# EAGLE design s-ispv2 (EAGLE 7.5.0)
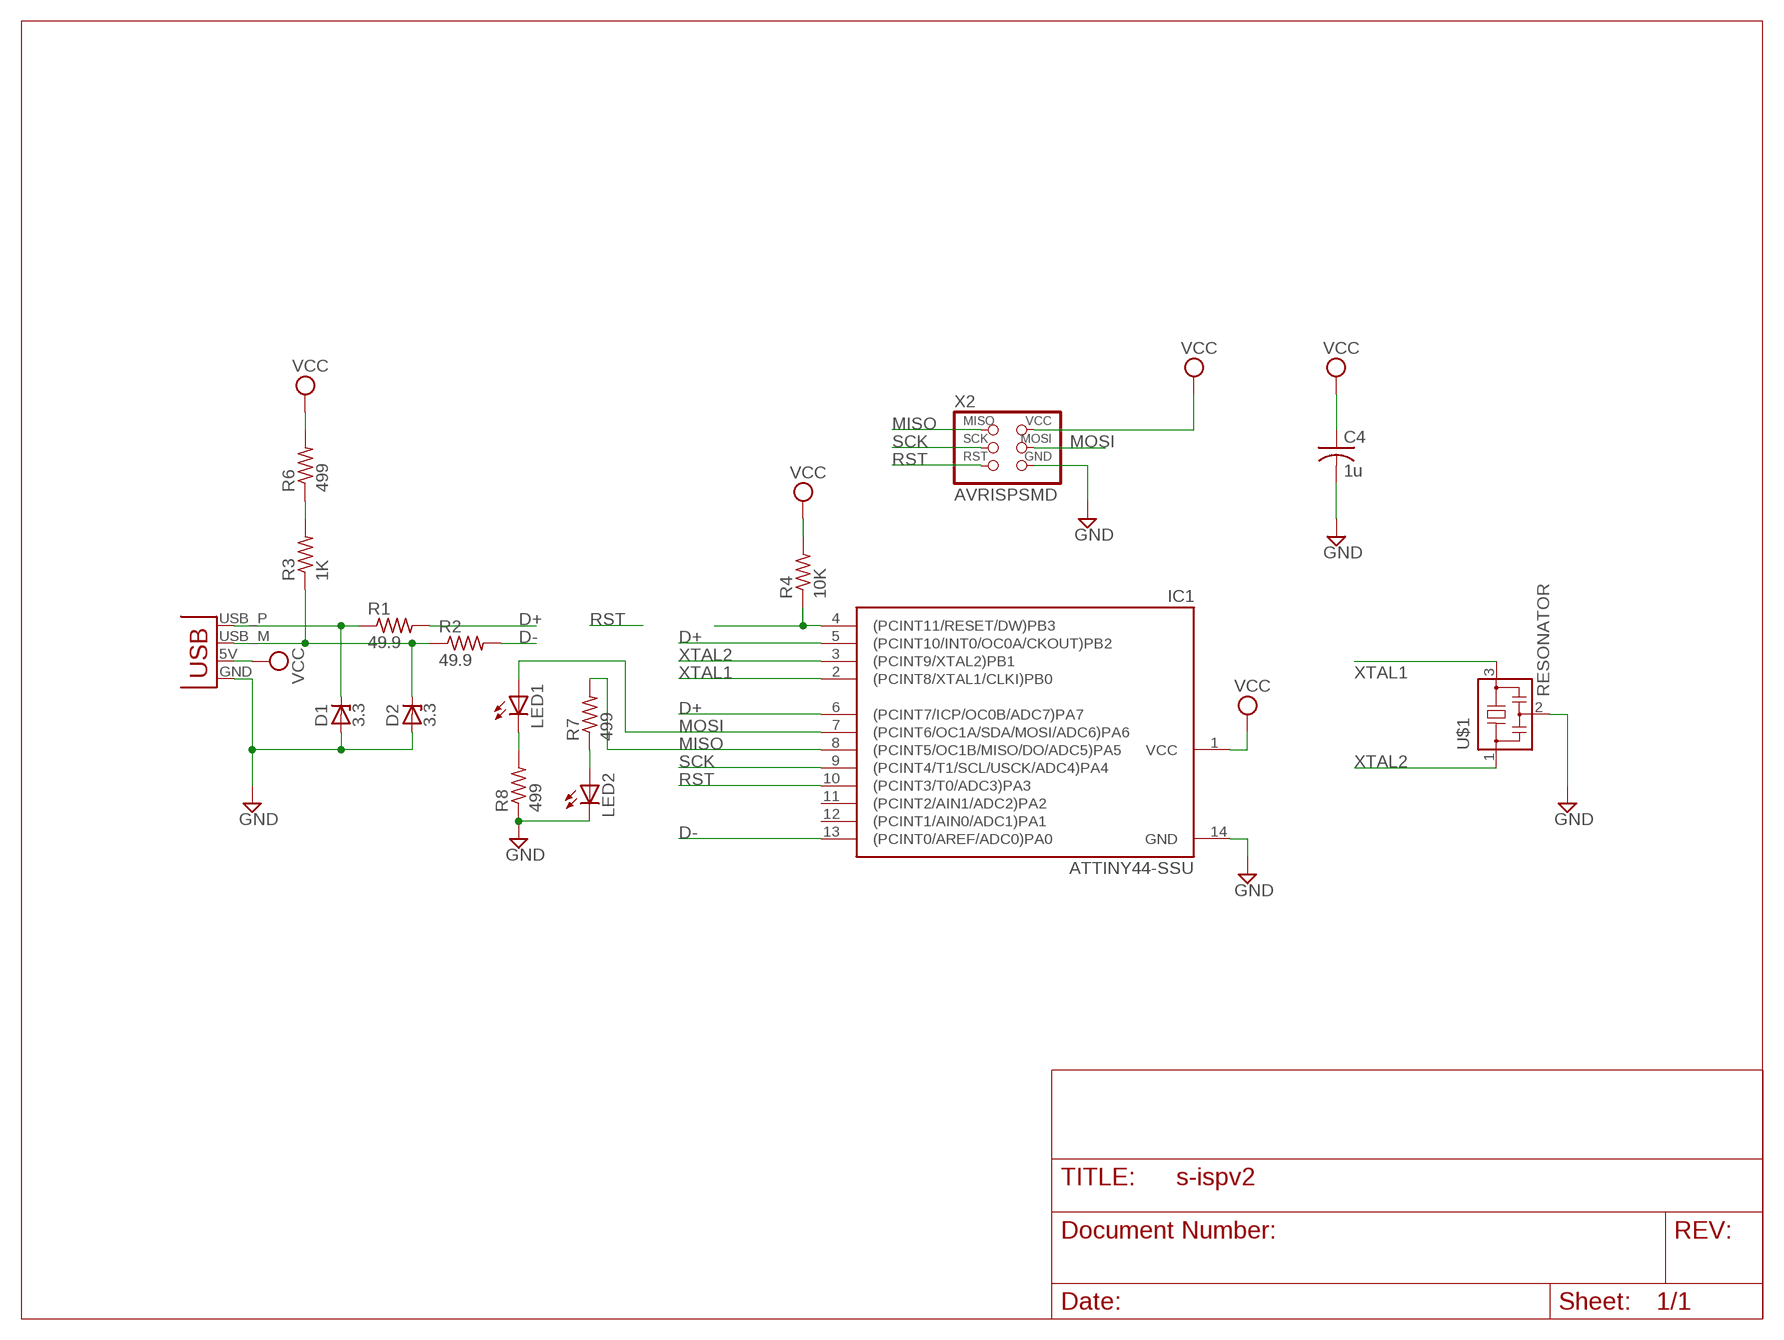
[diagram p0: schematic, sheet 1]

## Parts
C4  1u  C-USC1206  [C1206]
D1  3.3  ZENER_DIODESOD123  [SOD123]
D2  3.3  ZENER_DIODESOD123  [SOD123]
IC1  ATTINY44-SSU  [SOIC14]
LED1  LEDSMT1206  [1206]
LED2  LEDSMT1206  [1206]
R1  49.9  R-US_R1206  [R1206]
R2  49.9  R-US_R1206  [R1206]
R3  1K  R-US_R1206  [R1206]
R4  10K  R-US_R1206  [R1206]
R6  499  R-US_R1206  [R1206]
R7  499  R-US_R1206  [R1206]
R8  499  R-US_R1206  [R1206]
U$1  RESONATOR  [EFOBM]
X1  USBPCB  [USB-A-PCB]
X2  AVRISPSMD  [2X03SMD]

## Nets
D+: IC1.5((PCINT10/INT0/OC0A/CKOUT)PB2) IC1.6((PCINT7/ICP/OC0B/ADC7)PA7) R1.2
D-: IC1.13((PCINT0/AREF/ADC0)PA0) R2.2
GND: C4.2 D1.ANODE D2.ANODE IC1.14(GND) LED2.C R8.1 U$1.2 X1.GND X2.6(GND)
MISO: IC1.8((PCINT5/OC1B/MISO/DO/ADC5)PA5) R7.2 X2.1(MISO)
MOSI: IC1.7((PCINT6/OC1A/SDA/MOSI/ADC6)PA6) LED1.A X2.4(MOSI)
N$1: D1.CATHODE R1.1 X1.USB_P(D+)
N$2: D2.CATHODE R2.1 R3.1 X1.USB_M(D-)
N$6: R3.2 R6.1
N$7: LED1.C R8.2
N$8: LED2.A R7.1
RST: IC1.4((PCINT11/RESET/DW)PB3) IC1.10((PCINT3/T0/ADC3)PA3) R4.1 X2.5(RST)
SCK: IC1.9((PCINT4/T1/SCL/USCK/ADC4)PA4) X2.3(SCK)
VCC: C4.1 IC1.1(VCC) R4.2 R6.2 X1.5V(VBUS) X2.2(VCC)
XTAL1: IC1.2((PCINT8/XTAL1/CLKI)PB0) U$1.3
XTAL2: IC1.3((PCINT9/XTAL2)PB1) U$1.1
Unconnected: IC1.11((PCINT2/AIN1/ADC2)PA2) IC1.12((PCINT1/AIN0/ADC1)PA1)

## Library data of the parts
C4 = rcl:C-US: CAPACITOR, American symbol
D1 D2 = fab:ZENER_DIODE: zener diode
IC1 = fab:ATTINY44
LED1 LED2 = led:LED: LED OSRAM: - CHIPLED LG R971, LG N971, LY N971, LG Q971, LY Q971, LO R971, LY R971 LH N974, LH R974 LS Q976, LO Q976, LY Q976 LO Q996 - Hyper CHIPLED LW Q18S LB Q993, LB Q99A, LB R99A - SideLED LS A670, LO A670, LY A670, LG A670, LP A670 LB A673, LV A673, LT A673, LW A673 LH A674 LY A675 LS A676, LA A676, LO A676, LY A676, LW A676 LS A679, LY A679, LG A679 - Hyper Micro SIDELED® LS Y876, LA Y876, LO Y876, LY Y876 LT Y87S - SmartLED LW L88C, LW L88S LB L89C, LB L89S, LG L890 LS L89K, LO L89K, LY L89K LS L896, LA L896, LO L896, LY L896 - TOPLED LS T670, LO T670, LY T670, LG T670, LP T670 LSG T670, LSP T670, LSY T670, LOP T670, LYG T670 LG T671, LOG T671, LSG T671 LB T673, LV T673, LT T673, LW T673 LH T674 LS T676, LA T676, LO T676, LY T676, LB T676, LH T676, LSB T676, LW T676 LB T67C, LV T67C, LT T67C, LS T67K, LO T67K, LY T67K, LW E67C LS E67B, LA E67B, LO E67B, LY E67B, LB E67C, LV E67C, LT E67C LW T67C LS T679, LY T679, LG T679 LS T770, LO T770, LY T770, LG T770, LP T770 LB T773, LV T773, LT T773, LW T773 LH T774 LS E675, LA E675, LY E675, LS T675 LS T776, LA T776, LO T776, LY T776, LB T776 LHGB T686 LT T68C, LB T68C - Hyper Mini TOPLED® LB M676 - Mini TOPLED Santana® LG M470 LS M47K, LO M47K, LY M47K Source: http://www.osram.convergy.de LUXEON: - LUMILED® LXK2-PW12-R00, LXK2-PW12-S00, LXK2-PW14-U00, LXK2-PW14-V00 LXK2-PM12-R00, LXK2-PM12-S00, LXK2-PM14-U00 LXK2-PE12-Q00, LXK2-PE12-R00, LXK2-PE12-S00, LXK2-PE14-T00, LXK2-PE14-U00 LXK2-PB12-K00, LXK2-PB12-L00, LXK2-PB12-M00, LXK2-PB14-N00, LXK2-PB14-P00, LXK2-PB14-Q00 LXK2-PR12-L00, LXK2-PR12-M00, LXK2-PR14-Q00, LXK2-PR14-R00 LXK2-PD12-Q00, LXK2-PD12-R00, LXK2-PD12-S00 LXK2-PH12-R00, LXK2-PH12-S00 LXK2-PL12-P00, LXK2-PL12-Q00, LXK2-PL12-R00 Source: www.luxeon.com KINGBRIGHT: KA-3528ASYC Source: www.kingbright.com
R1-R4 R6-R8 = rcl:R-US_: RESISTOR, American symbol
U$1 = fab:RESONATOR
X1 = SparkFun:USB: USB Connectors USB-B-PTH is fully proven SKU : PRT-00139 USB-miniB is fully proven SKU : PRT-00587 USB-A-PCB is untested. USB-A-H is throughly reviewed, but untested. Spark Fun Electronics SKU : PRT-00437 USB-B-SMT is throughly reviewed, but untested. Needs silkscreen touching up. USB-A-S has not been used/tested USB-MB-H has not been used/tested
X2 = fab:AVRISP

## Board
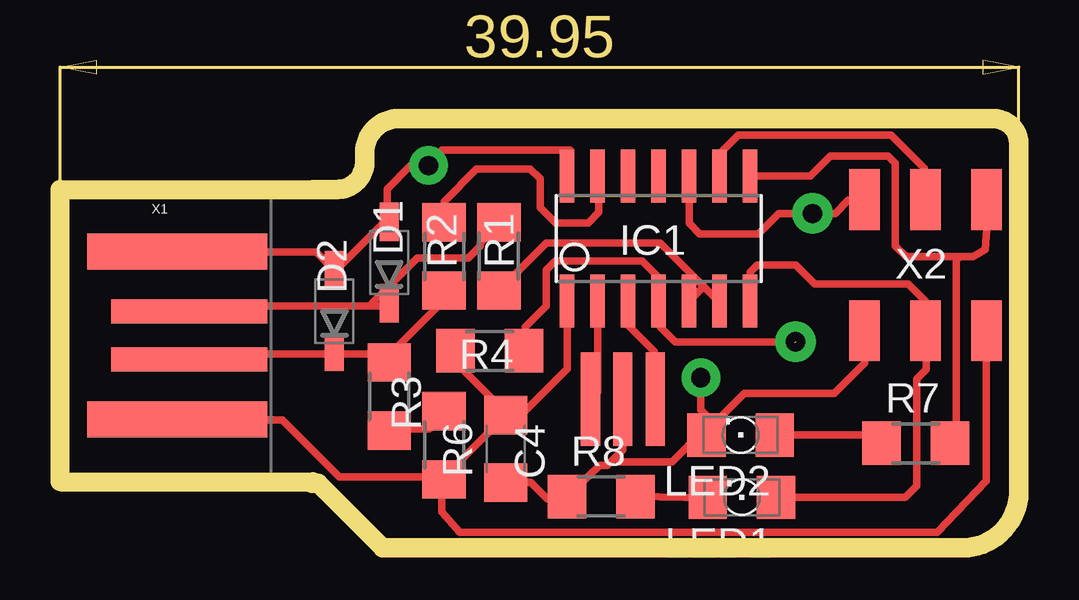
[diagram p1: board, top side]
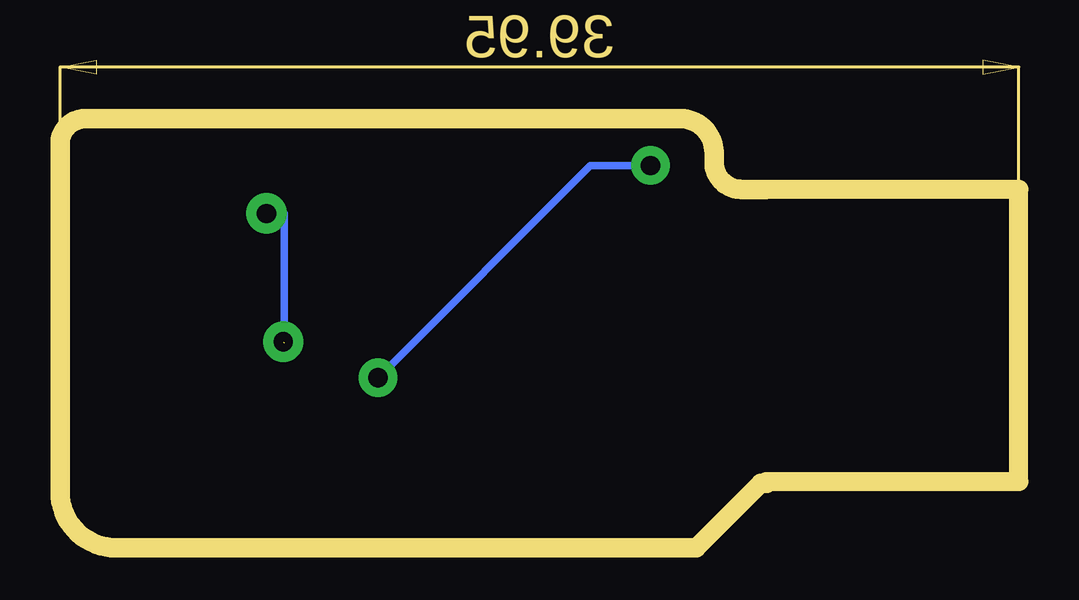
[diagram p2: board, bottom side, seen from below]

Size 39.95 x 5.4 mm. Coordinates in mm from the lower left corner, seen from the top.
Copper layers (1*16): Top 0.035mm / dielectric 1.5mm / Bottom 0.035mm
Design rules "fab": minimum track width 12mil, minimum drill 0.8mm, track to track 15.5mil, track to pad 15.5mil, pad to pad 15mil, via to via 15mil, smd to smd 10mil, copper to edge 0mil, drill to drill 1mm, minimum pad ring 0.2mm, minimum via ring 0.2mm, stop-mask expansion 4mil, vias tented up to drill 0mil, thermal gap 1mm
Milling: 16 lines

### Footprints (pad centres in the part's own frame; a part is rotated, then mirrored left to right if it is on the bottom)
C1206 = smd 1.6 x 1.8: 1 -1.4,0; 2 1.4,0
SOD123 = smd 1.6 x 0.8: ANODE 1.7,0; CATHODE -1.7,0
SOIC14 = smd 0.61 x 2.21: 1 -3.81,-2.603; 2 -2.54,-2.603; 3 -1.27,-2.603; 4 0,-2.603; 5 1.27,-2.603; 6 2.54,-2.603; 7 3.81,-2.603; 8 3.81,2.603; 9 2.54,2.603; 10 1.27,2.603; 11 0,2.603; 12 -1.27,2.603; 13 -2.54,2.603; 14 -3.81,2.603
1206 = smd 1.6 x 1.803: A -1.422,0; C 1.422,0
R1206 = smd 1.6 x 1.803: 1 -1.422,0; 2 1.422,0
EFOBM = smd 0.8 x 3.9: 1 -1.35,0; 2 0,0; 3 1.35,0
USB-A-PCB = smd 7.5 x 1.5: 5V -0.2,-3.5; GND -0.2,3.5 | smd 6.5 x 1: USB_M 0.3,-1; USB_P 0.3,1
2X03SMD = smd 2.54 x 1.27: 1 -2.54,2.54; 2 2.92,2.54; 3 -2.54,0; 4 2.92,0; 5 -2.54,-2.54; 6 2.92,-2.54

### Placement (x,y rotation side)
C4  18.57,-10.82 270 top  (outside the outline)
D1  13.72,-3.05 90 top
D2  11.43,-5.08 90 top  (outside the outline)
IC1  24.94,-2.05 0 top
LED1  28.41,-12.84 180 top  (outside the outline)
LED2  28.36,-10.24 180 top  (outside the outline)
R1  18.29,-2.79 270 top
R2  16,-2.79 90 top
R3  13.72,-8.64 270 top  (outside the outline)
R4  17.91,-6.73 180 top  (outside the outline)
R6  16,-10.67 270 top  (outside the outline)
R7  35.66,-10.58 0 top  (outside the outline)
R8  22.55,-12.81 0 top  (outside the outline)
U$1  23.45,-8.75 180 top  (outside the outline)
X1  5.08,-6.1 0 top
X2  36.06,-2.97 270 top

### Tracks (layer width: path | path; a pad name or v marks a point on that pad's centre or on a via)
D+
  Top 0.305: 26.81,-4.04 27.38,-4.6 IC1.6 | 26.81,-4.04 25,-2.23 20.25,-2.23 18.38,-4.1 R1.2 | 26.81,-4.04 26.25,-4.6 IC1.5
D-
  Top 0.305: R2.2 16,-0.5 17.35,0.85 19.6,0.85 20,0.45 20,-0.75 20.65,-1.4 22,-1.4 22.45,-0.95 22.45,0.51 IC1.13
GND  (via drill 0.8 pad 1.27)
  Top 0.305: 21.12,0.52 IC1.14 21.2,0.62 21.25,1.65 15.9,1.65 v15.35,1 14.6,1 13.62,0.02 13.62,-1.1 D1.ANODE 13.62,-1.23 11.5,-3.35 D2.ANODE 10.68,-2.6 5,-2.6 X1.GND 4.75,-2.6 3.25,-2.6 | 18.25,-12.35 18.5,-12.35 C4.2 19.62,-12.22 20.3,-12.9 21.09,-12.9 R8.1 22.49,-11.5 22.8,-11.5 23.15,-11.15 | 27.25,-9.75 28.5,-8.5 32.26,-8.5 33.52,-7.24 X2.6 | 27.25,-9.75 26.94,-10.06 | 26.94,-10.06 LED2.C | U$1.2 23.45,-10.85 23.15,-11.15 | 26.94,-10.06 26.79,-10.06 25.5,-11.35 23.35,-11.35 23.15,-11.15 | v26.7,-7.85 26.7,-9.2 27.25,-9.75
  Bottom 0.305: v15.35,1 17.85,1 v26.7,-7.85
MISO
  Top 0.305: R7.2 37.37,-10.58 37.35,-9.15 37.35,-2.95 37.5,-2.8 | IC1.8 31.26,0.55 32.1,1.4 34.5,1.4 34.8,1.1 34.8,-2.35 35.25,-2.8 37.5,-2.8 | 37.5,-2.8 38.05,-2.8 38.55,-2.5 38.7,-0.53 X2.1
MOSI
  Top 0.305: LED1.A 35.22,-12.84 35.7,-12.35 35.7,-7.9 36.1,-7.5 36.1,-5.93 X2.4 36.05,-4.65 35.35,-3.95 31.45,-3.95 30.65,-3.15 29.05,-3.15 28.75,-3.45 IC1.7
N$1
  Top 0.305: 13,-4.85 5.62,-4.85 X1.USB_P | 13,-4.85 13.62,-4.85 D1.CATHODE | R1.1 18.25,-1.48 17.5,-2.23 17.5,-2.35 17,-2.85 14.88,-2.85 13,-4.73 13,-4.85
N$2
  Top 0.305: R2.1 16,-4.6 13.62,-6.98 R3.1 13.62,-7.1 13.38,-6.85 11.5,-6.85 D2.CATHODE 11.38,-6.85 5.62,-6.85 X1.USB_M
N$6
  Top 0.305: R3.2 13.75,-9.98 15.38,-9.98 16,-9.35 R6.1
N$7
  Top 0.305: R8.2 26.97,-12.86 LED1.C
N$8
  Top 0.305: LED2.A 33.89,-10.24 R7.1
RST  (via drill 0.8 pad 1.68)  (1 unrouted)
  Top 0.305: IC1.10 26.21,-1.41 26.65,-1.85 29.1,-1.85 29.95,-1 v31.35,-1 32.3,-1 32.85,-0.45 33.5,-0.45 X2.5 | v30.65,-6.35 25.62,-6.35 25,-5.73 25,-4.73 IC1.4 24.88,-4.6 24.88,-3.6 24.25,-2.98 20.62,-2.98 20.25,-3.35 20.25,-4.85 19.38,-5.73 19.38,-6.73 R4.1
  Bottom 0.305: v31.35,-1 30.6,-1 30.6,-6.4
SCK
  Top 0.305: IC1.9 27.5,0.65 27.5,1.52 28.25,2.27 34.62,2.27 36,0.9 36,-0.37 X2.3
VCC
  Top 0.305: C4.1 18.5,-9.48 16,-11.98 R6.2 | R4.2 16.5,-6.85 16.5,-7.23 18.62,-9.35 C4.1 | IC1.1 21.12,-4.73 21.12,-7.48 19.25,-9.35 18.75,-9.35 C4.1 | R6.2 15.88,-11.98 11.62,-11.98 9.25,-9.6 5,-9.6 X1.5V | X2.2 38.6,-12.15 36.55,-14.3 16.65,-14.3 15.9,-13.45 15.9,-12.19 R6.2
XTAL1
  Top 0.305: IC1.2 22.4,-8.45 U$1.3
XTAL2
  Top 0.305: IC1.3 23.7,-4.68 23.7,-5.7 24.75,-6.75 24.75,-7.3 24.8,-7.35 U$1.1